# EAGLE design untitled (EAGLE 9.4.2)
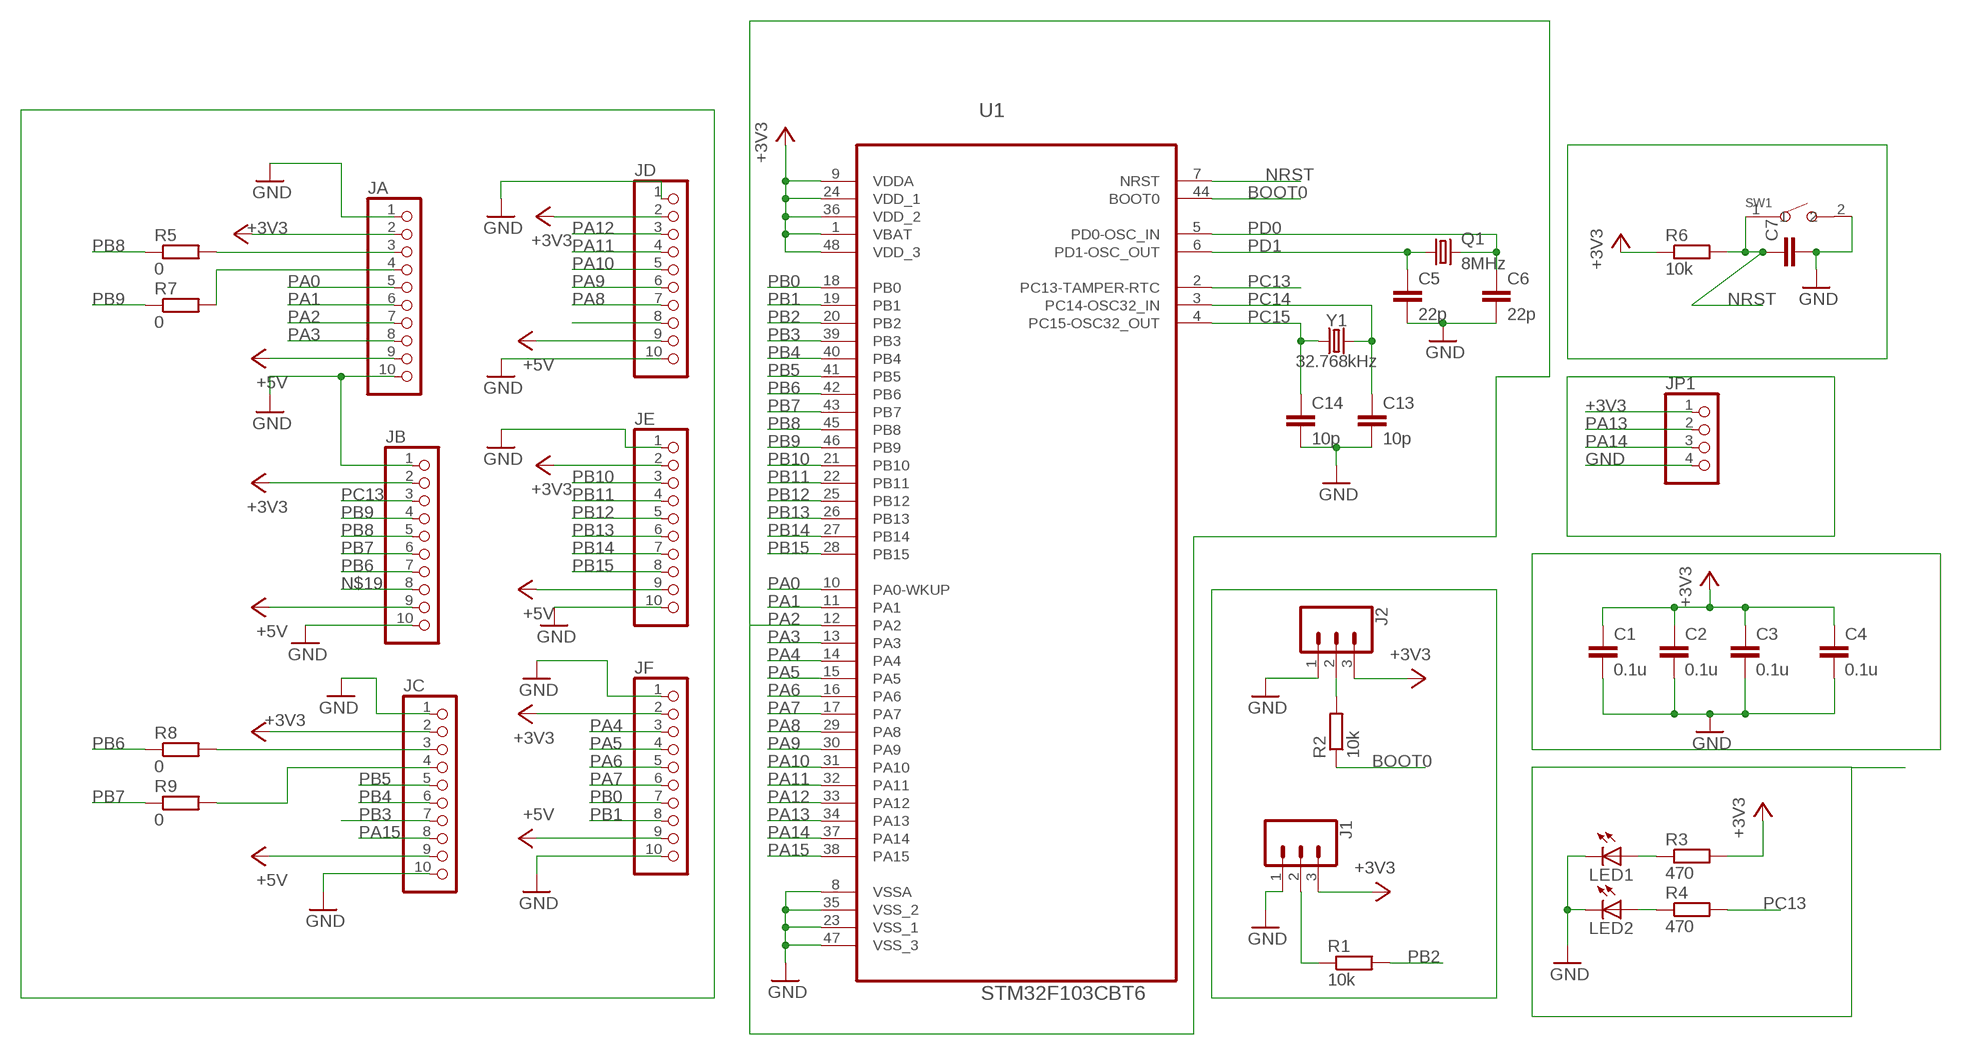
[diagram p0: schematic, sheet 1]

## Parts
C1  0.1u  C-EUC0805K  [C0805K]
C2  0.1u  C-EUC0805K  [C0805K]
C3  0.1u  C-EUC0805K  [C0805K]
C4  0.1u  C-EUC0805K  [C0805K]
C5  22p  C-EUC0805K  [C0805K]
C6  22p  C-EUC0805K  [C0805K]
C7  C-EUC0805K  [C0805K]
C13  10p  C-EUC1206K  [C1206K]
C14  10p  C-EUC1206K  [C1206K]
J1  CONN_03  [1X03]
J2  CONN_03  [1X03]
JA  PINHD-1X10  [1X10-BIG]
JB  PINHD-1X10  [1X10-BIG]
JC  PINHD-1X10  [1X10-BIG]
JD  PINHD-1X10  [1X10-BIG]
JE  PINHD-1X10  [1X10-BIG]
JF  PINHD-1X10  [1X10-BIG]
JP1  PINHD-1X4  [1X04]
LED1  LEDCHIPLED_0805  [CHIPLED_0805]
LED2  LEDCHIPLED_0805  [CHIPLED_0805]
Q1  8MHz  CRYSTALHC49S  [HC49/S]
R1  10k  R-EU_R0805  [R0805]
R2  10k  R-EU_R0805  [R0805]
R3  470  R-EU_R0805  [R0805]
R4  470  R-EU_R0805  [R0805]
R5  0  R-EU_R0805  [R0805]
R6  10k  R-EU_R0805  [R0805]
R7  0  R-EU_R0805  [R0805]
R8  0  R-EU_R0805  [R0805]
R9  0  R-EU_R0805  [R0805]
SW1  SMD-BUTTON(2P-6.0X3.0X2.5MM)-DHT-1163S  [SW2-4.0-6.0X3.0X2.5MM]
U1  STM32F103CBT6  [QFP50P900X900X160-48N]
Y1  32.768kHz  CRYSTAL-32.768KHZSMD-2X6  [CRYSTAL-SMD-2X6-CYL]

## Nets
+3V3: C1.1 C2.1 C3.1 C4.1 J1.3 J2.3 JA.2 JB.2 JC.2 JD.2 JE.2 JF.2 JP1.1 R3.2 R6.1 U1.1(VBAT) U1.9(VDDA) U1.24(VDD_1) U1.36(VDD_2) U1.48(VDD_3)
+5V: JA.9 JB.9 JC.9 JD.9 JE.9 JF.9
BOOT0: R2.1 U1.44(BOOT0)
GND: C1.2 C2.2 C3.2 C4.2 C5.2 C6.2 C7.2 C13.2 C14.2 J1.1 J2.1 JA.1 JA.10 JB.1 JB.10 JC.1 JC.10 JD.1 JD.10 JE.1 JE.10 JF.1 JF.10 JP1.4 LED1.C LED2.C SW1.2 U1.8(VSSA) U1.23(VSS_1) U1.35(VSS_2) U1.47(VSS_3)
N$1: J1.2 R1.1
N$2: J2.2 R2.2
N$3: JA.3 R5.2
N$4: LED1.A R3.1
N$5: JA.4 R7.2
N$6: LED2.A R4.1
N$7: JC.3 R8.2
N$8: JC.4 R9.2
N$12: JD.8
N$19: JB.8
NRST: C7.1 R6.2 SW1.1 U1.7(NRST)
PA0: JA.5 U1.10(PA0-WKUP)
PA1: JA.6 U1.11(PA1)
PA2: JA.7 U1.12(PA2)
PA3: JA.8 U1.13(PA3)
PA4: JF.3 U1.14(PA4)
PA5: JF.4 U1.15(PA5)
PA6: JF.5 U1.16(PA6)
PA7: JF.6 U1.17(PA7)
PA8: JD.7 U1.29(PA8)
PA9: JD.6 U1.30(PA9)
PA10: JD.5 U1.31(PA10)
PA11: JD.4 U1.32(PA11)
PA12: JD.3 U1.33(PA12)
PA13: JP1.2 U1.34(PA13)
PA14: JP1.3 U1.37(PA14)
PA15: JC.8 U1.38(PA15)
PB0: JF.7 U1.18(PB0)
PB1: JF.8 U1.19(PB1)
PB2: R1.2 U1.20(PB2)
PB3: JC.7 U1.39(PB3)
PB4: JC.6 U1.40(PB4)
PB5: JC.5 U1.41(PB5)
PB6: JB.7 R8.1 U1.42(PB6)
PB7: JB.6 R9.1 U1.43(PB7)
PB8: JB.5 R5.1 U1.45(PB8)
PB9: JB.4 R7.1 U1.46(PB9)
PB10: JE.3 U1.21(PB10)
PB11: JE.4 U1.22(PB11)
PB12: JE.5 U1.25(PB12)
PB13: JE.6 U1.26(PB13)
PB14: JE.7 U1.27(PB14)
PB15: JE.8 U1.28(PB15)
PC13: JB.3 R4.2 U1.2(PC13-TAMPER-RTC)
PC14: C13.1 U1.3(PC14-OSC32_IN) Y1.X2
PC15: C14.1 U1.4(PC15-OSC32_OUT) Y1.X1
PD0: C6.1 Q1.2 U1.5(PD0-OSC_IN)
PD1: C5.1 Q1.1 U1.6(PD1-OSC_OUT)

## Library data of the parts
C1-C7 C13 C14 = rcl:C-EU: CAPACITOR, European symbol; SPICEPREFIX: C
J1 J2 = SparkFun-Connectors:CONN_03: Multi connection point. Often used as Generic Header-pin footprint for 0.1 inch spaced/style header connections On any of the 0.1 inch spaced packages, you can populate with these: Break Away Headers - Straight <https://www.sparkfun.com/products/116> (PRT-00116) Break Away Male Headers - Right Angle <https://www.sparkfun.com/products/553> (PRT-00553) Female Headers <https://www.sparkfun.com/products/115> (PRT-00115) Break Away Headers - Machine Pin <https://www.sparkfun.com/products/117> (PRT-00117) Break Away Female Headers - Swiss Machine Pin <https://www.sparkfun.com/products/743> (PRT-00743) Stackable Header - 3 Pin (Female, 0.1") <https://www.sparkfun.com/products/13875> (PRT-13875) For SCREWTERMINALS and SPRING TERMINALS visit here: Screw Terimnals on SparkFun.com <https://www.sparkfun.com/search/results?term=Screw+Terminals> (5mm/3.5mm/2.54mm spacing) This device is also useful as a general connection point to wire up your design to another part of your project. Our various solder wires solder well into these plated through hole pads. Hook-Up Wire - Assortment (Stranded, 22 AWG) <https://www.sparkfun.com/products/11375> (PRT-11375) Hook-Up Wire - Assortment (Solid Core, 22 AWG) <https://www.sparkfun.com/products/11367> (PRT-11367) View the entire wire category on our website here <https://www.sparkfun.com/categories/141> Special notes: Molex polarized connector foot print use with SKU : PRT-08232 with associated crimp pins and housings.; PROD_ID: XXX-00000; VALUE: 455-1750-1-ND
JA JB JC JD JE JF = adafruit:PINHD-1X10: Pin header 1x10 0.1" spacing With round pins
JP1 = pinhead:PINHD-1X4: PIN HEADER
LED1 LED2 = adafruit:LED: LED OSRAM: - CHIPLED LG R971, LG N971, LY N971, LG Q971, LY Q971, LO R971, LY R971 LH N974, LH R974 LS Q976, LO Q976, LY Q976 LO Q996 - Hyper CHIPLED LW Q18S LB Q993, LB Q99A, LB R99A - SideLED LS A670, LO A670, LY A670, LG A670, LP A670 LB A673, LV A673, LT A673, LW A673 LH A674 LY A675 LS A676, LA A676, LO A676, LY A676, LW A676 LS A679, LY A679, LG A679 - Hyper Micro SIDELED® LS Y876, LA Y876, LO Y876, LY Y876 LT Y87S - SmartLED LW L88C, LW L88S LB L89C, LB L89S, LG L890 LS L89K, LO L89K, LY L89K LS L896, LA L896, LO L896, LY L896 - TOPLED LS T670, LO T670, LY T670, LG T670, LP T670 LSG T670, LSP T670, LSY T670, LOP T670, LYG T670 LG T671, LOG T671, LSG T671 LB T673, LV T673, LT T673, LW T673 LH T674 LS T676, LA T676, LO T676, LY T676, LB T676, LH T676, LSB T676, LW T676 LB T67C, LV T67C, LT T67C, LS T67K, LO T67K, LY T67K, LW E67C LS E67B, LA E67B, LO E67B, LY E67B, LB E67C, LV E67C, LT E67C LW T67C LS T679, LY T679, LG T679 LS T770, LO T770, LY T770, LG T770, LP T770 LB T773, LV T773, LT T773, LW T773 LH T774 LS E675, LA E675, LY E675, LS T675 LS T776, LA T776, LO T776, LY T776, LB T776 LHGB T686 LT T68C, LB T68C - Hyper Mini TOPLED® LB M676 - Mini TOPLED Santana® LG M470 LS M47K, LO M47K, LY M47K Source: http://www.osram.convergy.de/
Q1 = adafruit:CRYSTAL: CRYSTAL; OC_FARNELL: 1667008; OC_NEWARK: unknown
R1-R9 = rcl:R-EU_: RESISTOR, European symbol; SPICEPREFIX: R
SW1 = Seeed-OPL-Switch:SMD-BUTTON(2P-6.0X3.0X2.5MM): 311020029
U1 = ST Microelctronics_By_element14_Batch_1:STM32F103CBT6: Medium-density performance line ARM-based 32-bit MCU; MPN: STM32F103CBT6; OC_FARNELL: 1606327; OC_NEWARK: 11N8296; PACKAGE: QFP-48; SUPPLIER: STMICROELECTRONICS
Y1 = SparkFun-Clocks:CRYSTAL-32.768KHZ: 32.768kHz Crystal Frequency: 32.768kHz Frequency Stability: ±20ppm Load Capacitance: 12.5pF (PTH-2X6 & SMD-3.2X1.5), 6pF (SMD-2X6) SparkFun Products: SparkFun BigTime Watch Kit <https://www.sparkfun.com/products/11734> SparkFun nRF52832 Breakout <https://www.sparkfun.com/products/13990> SparkFun Real Time Clock Module <https://www.sparkfun.com/products/12708>; PROD_ID: XTAL-07894

## Board
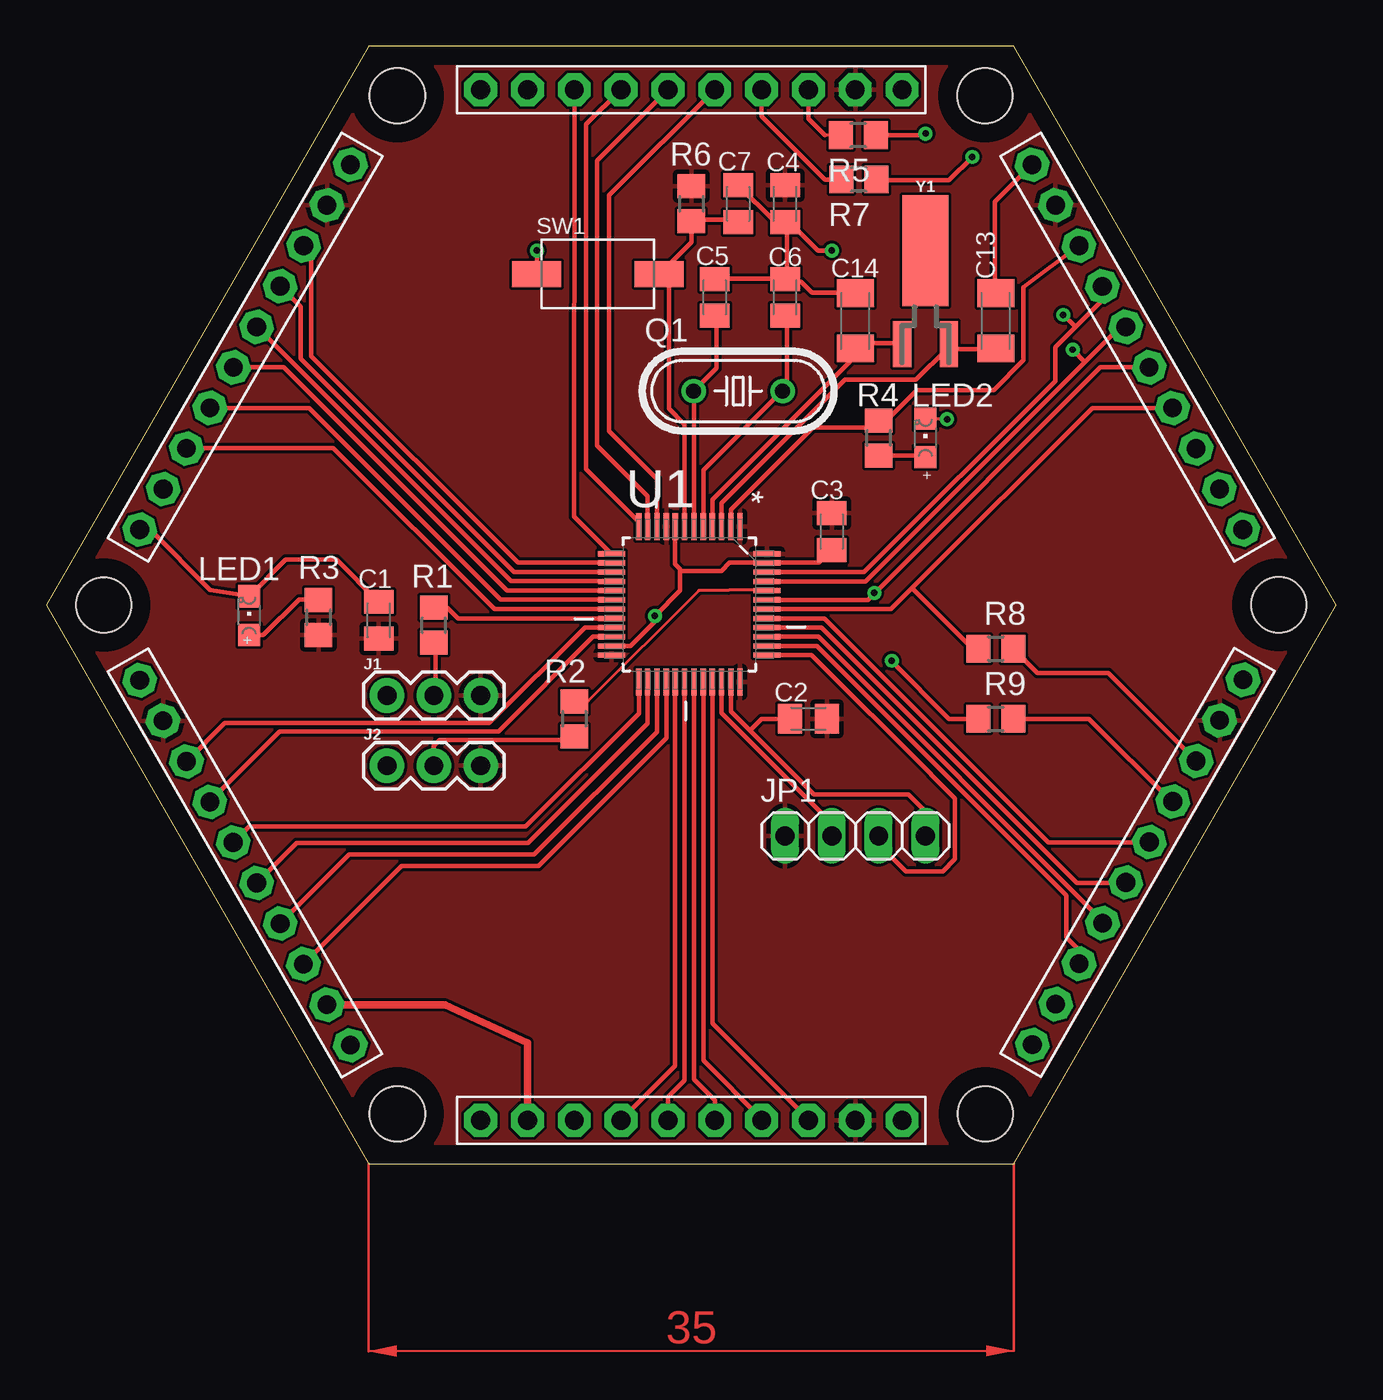
[diagram p1: board, top side]
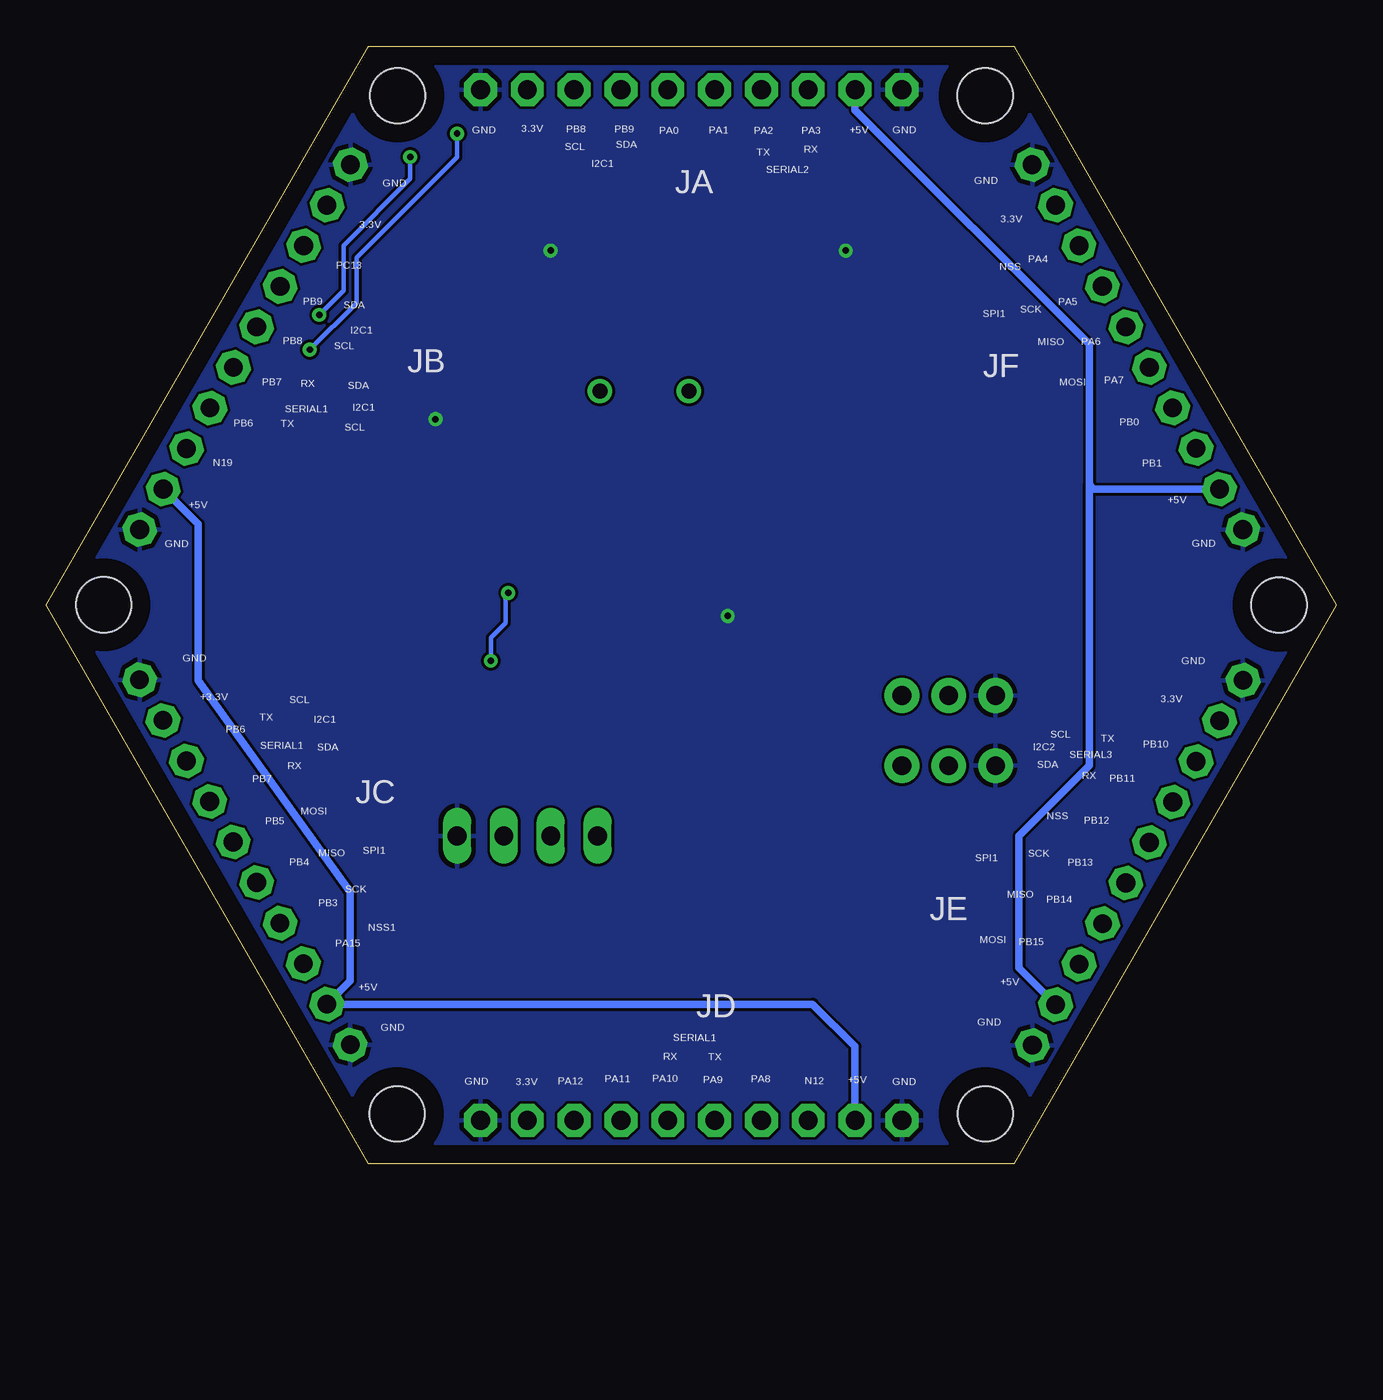
[diagram p2: board, bottom side, seen from below]

Size 70 x 60.63 mm. Coordinates in mm from the lower left corner, seen from the top.
Outline: 52.5,0.01 70,30.32 52.5,60.63 17.5,60.62 0,30.31 17.5,0 52.5,0.01
Copper layers (1*16): Top 0.035mm / dielectric 1.5mm / Bottom 0.035mm
Design rules "default": minimum track width 6mil, minimum drill 0.35mm, track to track 6mil, track to pad 6mil, pad to pad 6mil, via to via 6mil, smd to smd 6mil, copper to edge 40mil, drill to drill 6mil, minimum pad ring 10mil, minimum via ring 8mil, stop-mask expansion 4mil, vias tented up to drill 0mil, thermal gap 10mil
Holes 3 mm at 19.05,57.93 50.93,57.93 66.88,30.32 3.12,30.31 19.05,2.7 50.95,2.7

### Footprints (pad centres in the part's own frame; a part is rotated, then mirrored left to right if it is on the bottom)
C0805K = smd 1.3 x 1.6: 1 -1,0; 2 1,0
C1206K = smd 1.5 x 2: 1 -1.5,0; 2 1.5,0
1X03 = drill 1.016 pad 1.88: 1 0,0; 2 2.54,0; 3 5.08,0
1X10-BIG = drill 1.016 pad 1.778 octagon: 1 -11.43,0; 2 -8.89,0; 3 -6.35,0; 4 -3.81,0; 5 -1.27,0; 6 1.27,0; 7 3.81,0; 8 6.35,0; 9 8.89,0; 10 11.43,0
1X04 = drill 1.016 long: 1 -3.81,0; 2 -1.27,0; 3 1.27,0; 4 3.81,0
CHIPLED_0805 = smd 1.2 x 1.2: A 0,-1.05; C 0,1.05
HC49/S = drill 0.813: 1 -2.413,0; 2 2.413,0
R0805 = smd 1.3 x 1.5: 1 -0.95,0; 2 0.95,0
SW2-4.0-6.0X3.0X2.5MM = smd 2.65 x 1.4: 1 -3.325,0; 2 3.325,0
QFP50P900X900X160-48N = smd 1.473 x 0.279: 1 -4.216,2.743; 2 -4.216,2.261; 3 -4.216,1.753; 4 -4.216,1.245; 5 -4.216,0.762; 6 -4.216,0.254; 7 -4.216,-0.254; 8 -4.216,-0.762; 9 -4.216,-1.245; 10 -4.216,-1.753; 11 -4.216,-2.261; 12 -4.216,-2.743; 25 4.216,-2.743; 26 4.216,-2.261; 27 4.216,-1.753; 28 4.216,-1.245; 29 4.216,-0.762; 30 4.216,-0.254; 31 4.216,0.254; 32 4.216,0.762; 33 4.216,1.245; 34 4.216,1.753; 35 4.216,2.261; 36 4.216,2.743 | smd 0.279 x 1.473: 13 -2.743,-4.216; 14 -2.261,-4.216; 15 -1.753,-4.216; 16 -1.245,-4.216; 17 -0.762,-4.216; 18 -0.254,-4.216; 19 0.254,-4.216; 20 0.762,-4.216; 21 1.245,-4.216; 22 1.753,-4.216; 23 2.261,-4.216; 24 2.743,-4.216; 37 2.743,4.216; 38 2.261,4.216; 39 1.753,4.216; 40 1.245,4.216; 41 0.762,4.216; 42 0.254,4.216; 43 -0.254,4.216; 44 -0.762,4.216; 45 -1.245,4.216; 46 -1.753,4.216; 47 -2.261,4.216; 48 -2.743,4.216
CRYSTAL-SMD-2X6-CYL = smd 2.5 x 6: SHEILD 0,5.08 | smd 1 x 2.5: X1 -1.27,0; X2 1.27,0

### Placement (x,y rotation side)
C1  18.05,29.48 90 top
C2  41.35,24.13 180 top
C3  42.62,34.29 270 top
C4  40.08,52.07 270 top
C5  36.27,46.99 90 top
C6  40.08,46.99 90 top
C7  37.54,52.07 90 top
C13  51.51,45.72 90 top
C14  43.89,45.72 90 top
J1  18.49,25.4 0 top
J2  18.49,21.59 0 top
JA  35,58.26 180 top
JB  59.21,44.3 300 top
JC  59.21,16.35 240 top
JD  35,2.35 180 top
JE  10.79,16.33 300 top
JF  10.79,44.3 240 top
JP1  43.89,17.78 0 top
LED1  11.01,29.73 0 top
LED2  47.7,39.37 0 top
Q1  37.54,41.91 0 top
R1  21.03,29.21 90 top
R2  28.65,24.13 270 top
R3  14.78,29.64 270 top
R4  45.16,39.37 90 top
R5  44.06,55.79 180 top
R6  35,52.07 270 top
R7  44.09,53.39 180 top
R8  51.51,27.94 0 top
R9  51.51,24.13 0 top
SW1  29.92,48.26 180 top
U1  34.89,30.34 270 top
Y1  47.7,44.45 0 top

### Tracks (layer width: path | path; a pad name or v marks a point on that pad's centre or on a via)
+3V3
  pour Top: 15.49,63.03 56.28,63 74.75,28.18 54.46,-2.25 14.07,-2.25 -4.46,29.13
+5V
  Top 0.152: JD.9 26.12,2.42
  Top 0.406: 26.12,2.42 26.12,6.56 21.66,8.61 21.64,8.63 JE.9
  Bottom 0.152: 7.09,36.6 JF.9 | JF.9
  Bottom 0.406: 7.09,36.6 13.18,36.6 13.41,36.83 | 53.5,9.92 53.5,14.73 61.74,26.21 61.74,34.69 JB.9 | JA.9 26.11,57.15 13.41,44.45 13.41,36.83 | JD.9 26.11,6.35 28.42,8.65 JC.9 | 13.41,36.83 13.41,21.59 17.22,17.78 17.22,10.62 JE.9 | 53.5,9.92 | 53.5,9.92 JC.9 | JC.9
BOOT0
  Top 0.152: U1.44 37.03,31.11 37.03,31.1 35.41,31.1 29.41,25.1 28.67,25.1 R2.1
  Top 0.254: U1.44
GND  (via drill 0.35)
  Top 0.152: 34.39,32.26 34.39,32.16 | 39.04,32.61 U1.47 | 40.03,48.01 C6.2 | 40.19,51.06 C4.2 | 40.19,48.01 C6.2 | 39.42,51.21 40.03,51.21 C4.2 | 37.6,53.04 C7.2 | 43.84,47.25 C14.2 | 40.19,47.86 C6.2 | LED1.C | v48.87,40.39 47.81,40.39 LED2.C | JB.1 53.47,54.19 | 51.46,47.25 C13.2 | 26.62,48.31 SW1.2 | 40.19,51.21 C4.2 | 47.7,19.05 47.7,19.1 | JF.10 | 46.77,20.02
  Top 0.254: U1.23 31.7,28.08 33.02,29.4 v33.02,29.72 34.39,31.09 34.39,32.16 36.63,32.16 37.07,32.6 U1.47 | 34.39,32.26 34.13,32.53 U1.8 | 40.03,48.01 36.38,48.01 C5.2 | 40.19,48.01 40.19,51.06 | 39.42,51.21 37.6,53.04 | 43.84,47.25 41.56,47.25 40.95,47.86 40.19,47.86 | JF.10 5.64,34.4 8.91,31.13 LED1.C | C1.2 15.76,32.77 13,32.77 LED1.C | 51.46,47.25 51.46,52.18 53.47,54.19 | v26.62,49.53 26.62,48.31 | v42.62,49.53 41.86,49.53 40.19,51.21 | U1.35 37.15,24.52 38.18,23.5 | 38.18,23.5 41.65,20.02 46.77,20.02 47.7,19.1 | 47.7,19.05 JP1.4 | C2.2 38.81,24.13 38.18,23.5 | C3.2 41.94,32.61 39.04,32.61
  pour Bottom: 15.95,62.23 53.13,62.23 72.75,28.34 53.56,-1.27 14.29,-1.27 -2.96,29.65
N$1
  Top 0.152: 21.14,28.2 R1.1 | 21.14,25.45 J1.2
  Top 0.254: 21.14,25.45 21.14,28.2
N$2
  Top 0.152: 27.99,22.98 R2.2
  Top 0.254: 27.99,22.98 21.36,22.98 21.03,22.66 J2.2
N$3
  Top 0.152: R5.2 42.25,55.79
  Top 0.254: 42.25,55.79 41.35,56.69 JA.3
N$4
  Top 0.152: R3.1 14.75,30.61
  Top 0.254: LED1.A 11.78,28.68 13.71,30.61 14.75,30.61
N$5
  Top 0.152: JA.4
  Top 0.254: R7.2 42.25,53.39 38.81,56.82 JA.4
N$6
  Top 0.152: 47.65,38.41 LED2.A | 45.22,38.41 R4.1
  Top 0.254: 45.22,38.41 47.65,38.41
N$7
  Top 0.152: JC.3
  Top 0.254: R8.2 53.78,26.63 57.61,26.63 JC.3
N$8
  Top 0.152: 61.06,19.65 JC.4
  Top 0.254: R9.2 56.57,24.13 61.06,19.65
NRST
  Top 0.152: 35,51.21 R6.2 | 37.44,51.21 C7.1 | 33.79,47.7 33.33,48.16 SW1.1 33.33,48.31 | 34.64,34.61
  Top 0.254: 37.44,51.21 35,51.21 | 34.64,34.61 34.64,40.1 33.79,40.96 33.79,47.7 | 34.64,34.61 U1.7 | R6.2 35,49.99 33.33,48.31
PA0
  Top 0.254: U1.10 33.14,37.13 30.53,39.73 30.53,52.53 JA.5
PA1
  Top 0.254: JA.6 29.88,54.42 29.88,38.96 32.63,36.21 U1.11
PA2
  Top 0.254: JA.7 29.3,56.38 29.3,37.69 32.15,34.85 U1.12
PA3
  Top 0.254: JA.8 28.65,35.11 U1.13
PA4
  Top 0.152: 14.43,49.23 14.38,49.23
  Top 0.254: U1.14 30.66,32.6 25.6,32.6 14.38,43.82 14.38,49.23 | 14.43,49.23 13.97,49.68 JF.3
PA5
  Top 0.254: U1.15 25.39,32.1 13.82,43.66 13.82,46.48 JF.4
PA6
  Top 0.152: JF.5
  Top 0.254: U1.16 30.66,31.6 25.23,31.6 JF.5
PA7
  Top 0.152: JF.6 10.17,43.21
  Top 0.254: U1.17 30.58,31.09 25.01,31.09 12.89,43.21 10.17,43.21
PA8
  Top 0.152: U1.29 34.13,26.09
  Top 0.254: 34.13,26.09 34.13,5.31 31.22,2.4 JD.7
PA9
  Top 0.152: 34.64,25.94
  Top 0.254: 34.64,25.94 34.64,4.52 33.75,3.62 33.75,2.41 JD.6 | 34.64,25.94 U1.30
PA10
  Top 0.152: 35.14,26.05 35.15,26.05
  Top 0.254: 35.15,26.05 35.15,4.58 36.28,3.45 JD.5 | 35.14,26.05 U1.31
PA11
  Top 0.152: 35.65,26.07
  Top 0.254: U1.32 35.65,26.07 | 35.65,26.07 35.65,5.6 38.81,2.44 JD.4
PA12
  Top 0.152: 36.14,25.95 36.14,25.96
  Top 0.254: U1.33 36.14,25.95 | 36.14,25.96 36.14,7.61 41.35,2.4 JD.3
PA13
  Top 0.254: U1.34 36.64,24.46 42.28,18.82 42.28,18.13 JP1.2
PA14
  Top 0.152: 48.02,21.1 48.01,21.1
  Top 0.254: 48.01,21.1 49.31,19.8 49.31,16.53 48.64,15.86 46.64,15.86 45.16,17.33 JP1.3 | 48.02,21.1 41.52,27.6 U1.37
PA15
  Top 0.152: 47.94,21.95 47.93,21.95
  Top 0.254: U1.38 | U1.38 41.81,28.08 47.93,21.95 | 47.94,21.95 55.35,14.54 55.35,12.27 56.04,11.58 56.04,10.98 JC.8
PB0
  Top 0.152: JF.7 8.9,40.99 | JF.7
  Top 0.254: U1.18 30.66,30.6 24.65,30.6 14.26,40.99 8.9,40.99
PB1
  Top 0.2: JF.8 7.64,38.82
  Top 0.254: U1.19 24.32,30.08 15.58,38.82 7.64,38.82
PB2
  Top 0.254: U1.20 22.35,29.57 21.75,30.18 21.14,30.18 R1.2
PB3
  Top 0.152: JC.7 57.31,13.18
  Top 0.254: U1.39 41.9,28.59 57.31,13.18 | U1.39
PB4
  Top 0.152: JC.6 58.57,15.24
  Top 0.254: U1.40 42.06,29.09 55.91,15.24 58.57,15.24
PB5
  Top 0.152: JC.5 59.83,17.43
  Top 0.254: U1.41 42.23,29.58 54.37,17.43 59.83,17.43
PB6
  Top 0.152: JB.7
  Top 0.254: U1.42 45.84,30.08 46.97,31.21 | 46.97,31.21 56.76,41 JB.7 | R8.1 50.24,27.94 46.97,31.21
PB7  (via drill 0.35)
  Top 0.152: JB.6 | 45.87,27.23 v45.87,27.28
  Top 0.254: U1.43 44.59,30.59 44.93,30.94 | JB.6 57.2,43.2 44.93,30.94 | v44.93,30.96 44.93,30.94 | R9.1 48.97,24.13 45.87,27.23
  Bottom 0.152: 45.07,30.82 v44.93,30.96
  Bottom 0.254: 45.07,30.82 45.07,29.33 45.87,28.53 v45.87,27.28
PB8  (via drill 0.35)
  Top 0.152: JB.5 | v47.7,55.88 47.61,55.79
  Top 0.254: 56.36,43.49 58.26,45.39 JB.5 | 56.36,43.49 44.45,31.58 U1.45 | 56.36,43.49 v55.69,44.16 | 47.61,55.79 R5.1
  Bottom 0.254: v55.69,44.16 53.16,46.69 53.16,49.16 47.7,54.61 v47.7,55.88
PB9  (via drill 0.35)
  Top 0.152: 45.08,53.34 R7.1 | 55.75,45.48 55.75,45.3
  Top 0.254: JB.4 57.3,46.86 55.75,45.3 54.74,44.29 54.74,42.46 44.37,32.09 U1.46 | v50.24,54.61 48.97,53.34 45.08,53.34 | v55.18,46.04 55.75,45.48
  Bottom 0.254: v55.18,46.04 53.85,47.37 53.85,49.81 50.24,53.42 v50.24,54.61
PB10
  Top 0.152: JE.3
  Top 0.254: U1.21 | U1.21 29.24,29.09 24.04,23.9 9.69,23.9 JE.3
PB11
  Top 0.254: U1.22 29.67,28.58 24.53,23.45 12.68,23.45 8.88,19.65 JE.4
PB12
  Top 0.254: U1.25 32.15,24.43 26.01,18.29 11.01,18.29 JE.5
PB13
  Top 0.152: JE.6
  Top 0.254: U1.26 | U1.26 32.63,23.87 26.16,17.4 13.6,17.4 JE.6
PB14
  Top 0.152: JE.7
  Top 0.254: U1.27 33.14,23.42 26.48,16.77 16.44,16.77 JE.7
PB15
  Top 0.152: JE.8 13.96,10.84
  Top 0.254: U1.28 33.65,23.09 26.73,16.16 19.28,16.16 13.96,10.84
PC13
  Top 0.152: 44.76,39.93 45.06,40.24 R4.2 45.22,40.39 45.67,40.39
  Top 0.254: U1.2 37.15,35.49 41.59,39.93 44.76,39.93 | 45.67,40.39 47.25,41.97 51.41,41.97 53.03,43.59 53.03,47.56 JB.3
PC14
  Top 0.152: 51.46,44.2 C13.1 | 49.03,44.35 48.87,44.2 Y1.X2 49.03,44.35
  Top 0.254: U1.3 36.65,35.85 43.32,42.52 47.2,42.52 48.87,44.2 51.46,44.2
PC15
  Top 0.152: 43.84,43.74 43.84,44.2 C14.1 44,44.35 44.15,44.5 | 46.43,44.5 Y1.X1
  Top 0.254: 43.84,43.74 36.14,36.04 U1.4 | 44.15,44.5 46.43,44.5
PD0
  Top 0.152: Q1.2 39.93,41.91 | 40.19,45.87 C6.1
  Top 0.254: U1.5 35.65,37.63 39.93,41.91 | 40.19,45.87 40.19,41.91 Q1.2
PD1
  Top 0.152: C5.1 36.38,45.87
  Top 0.254: U1.6 35.14,36.76 | 35.14,36.76 | 36.38,45.87 36.38,43.16 Q1.1 35.14,41.9 35.14,36.76
(copper drawn outside any net)
  shapes: Top area x1

### Text on the board
tNames: + | +
bNames: GND | +5V | PA3 | PA2 | PA1 | PA0 | PB9 | PB8 | 3.3V | GND | RX | TX | SDA | SCL | SERIAL2 | I2C1 | GND | GND | 3.3V | 3.3V | PA4 | PC13 | NSS | PA5 | PB9 | SCK | SPI1 | SDA | I2C1 | PA6 | MISO | SCL | PB8 | PA7 | MOSI | SDA | RX | PB7 | I2C1 | SERIAL1 | PB0 | SCL | TX | PB6 | PB1 | N19 | +5V | +5V | GND | GND | GND | GND | 3.3V | SCL | +3.3V | I2C1 | TX | PB10 | TX | SCL | PB6 | SERIAL3 | I2C2 | SDA | SERIAL1 | PB11 | RX | SDA | RX | PB7 | NSS | MOSI | PB12 | PB5 | SCK | SPI1 | MISO | PB13 | SPI1 | PB4 | SCK | PB14 | MISO | PB3 | NSS1 | PB15 | MOSI | PA15 | +5V | +5V | GND | SERIAL1 | GND | TX | RX | GND | N12 | PA8 | PA9 | PA10 | PA11 | PA12 | 3.3V | GND | +5V